# Altium schematic sheet Buzzer.SchDoc
size A3; SheetNumber: 6; SheetTotal: 6
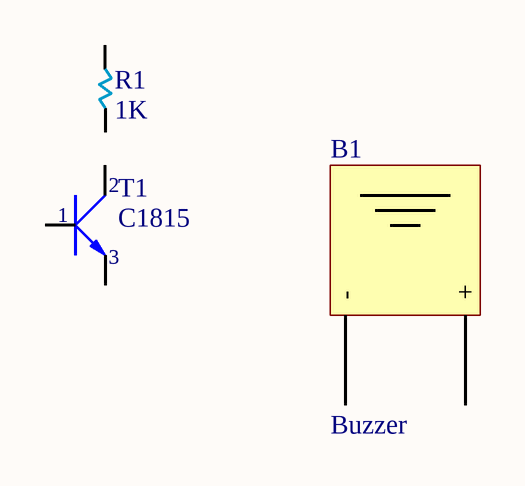
[diagram p0: Buzzer.SchDoc]

## Parts
B1  Buzzer  [Buzzer]
R1  1K  [RES 0805]
T1  C1815  [SOT23-3]

## Nets

Not connected (* = marked no-connect by the designer): B1 + -; R1 1 2; T1 1(B) 2(E) 3(C)

## Library data of the parts
B1 = Buzzer: 12xx
R1 = RES: Value: 1K
T1 = NPN SM